# Altium project LM2596_DC_DC_BUCKCONVERTER.PrjPcb
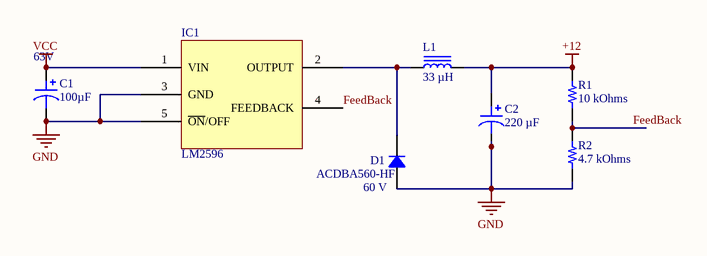
[diagram p0: Sheet1.SchDoc]
1 sheet, 7 parts. Net scope: global (net labels, ports and power ports of the same name join across sheets).
Board file: PCB1.PcbDoc

## Sheet Sheet1.SchDoc
size B; SheetNumber: 1; SheetTotal: 1

### Parts
C1  100µF  Voltage - Rated: 63V  [CAP TH ALUM ELEC D10.00mm S5.00mm H10.50mm]
C2  220 µF  [CAP TH ALPOLY D8.00mm S3.50mm H13.50mm]
D1  ACDBA560-HF  Voltage - DC Reverse (Vr) (Max): 60 V  [DO214AC SMA]
IC1  LM2596  [D2PAK]
L1  33 µH  [BOURNS SRR1280]
R1  10 kOhms  [RES 0805_2012]
R2  4.7 kOhms  [RES 0805_2012]

### Nets
+12: C2.1 L1.2 R1.2
GND: C1.2 C2.2 D1.1 IC1.3(GND) IC1.5(~{ON}/OFF) R2.1
VCC: C1.1 IC1.1(VIN)
FeedBack: IC1.4(FEEDBACK) R1.1 R2.2
NetD1_2: D1.2 IC1.2(OUTPUT) L1.1

### Library data of the parts
C1 = URS1J101MPD1TD: CAP ALUM 100UF 20% 63V RADIAL; manufacturer: Nichicon; Lifetime @ Temp.: 2000 Hrs @ 85°C; Polarization: Polar; Ripple Current @ High Frequency: 375mA @ 10kHz; Ripple Current @ Low Frequency: 250mA @ 120Hz; Part Number: URS1J101MPD1TD; Applications: General Purpose; Capacitance: 100µF; componentlink1description: Datasheet; componentlink1url: http://nichicon-us.com/english/products/pdfs/e-urs.pdf; componentlink2description: DigiKey Link; componentlink2url: http://digikey.com/product-detail/en/nichicon/URS1J101MPD1TD/493-11829-1-ND/4320229; Device Package: Radial, Can; Height - Seated (Max): 0.413" (10.50mm); lastupdated: 2.09.2020 01:26:22; Lead Spacing: 0.197" (5.00mm); Lifecycle Status: Active; Minimum Order: 1; Mounting Type: Through Hole; Operating Temperature: -40°C ~ 85°C; Package / Case: Radial, Can; packaging: TapeAndBox; partid: 9501; Part Status: Active; price: 0.18; series: URS; Size / Dimension: 0.394" Dia (10.00mm); Supplier 1: DigiKey; Supplier Part Number 1: 493-11829-1-ND; Tolerance: ±20%; value: 100µF
C2 = 227AVG035MFBJ: CAP ALUM POLY 220UF 20% 35V T/H; manufacturer: Illinois Capacitor; ESR (Equivalent Series Resistance): 26mOhm; Lifetime @ Temp.: 1500 Hrs @ 125°C; Ripple Current @ High Frequency: 2.95 A @ 100 kHz; Ripple Current @ Low Frequency: 147.5 mA @ 120 Hz; Type: Polymer; Part Number: 227AVG035MFBJ; Value: 220 µF; Applications: General Purpose; Capacitance: 220 µF; componentlink1description: Datasheet; componentlink1url: http://www.illinoiscapacitor.com/pdf/seriesDocuments/AVG%20series.pdf; componentlink2description: DigiKey Link; componentlink2url: https://www.digikey.com/en/products/detail/illinois-capacitor/227AVG035MFBJ/5411696; Device Package: Radial, Can; Height - Seated (Max): 0.532" (13.50mm); lastupdated: 6.05.2023 20:46:02; Lead Spacing: 0.138" (3.50mm); Lifecycle Status: Active; Minimum Order: 1; Mounting Type: Through Hole; Operating Temperature: -55°C ~ 125°C; Package / Case: Radial, Can; packaging: Bulk; partid: 3875; Part Status: Active; price: 1.05; series: AVG; Size / Dimension: 0.315" Dia (8.00mm); Supplier 1: DigiKey; Supplier Part Number 1: 1572-1695-ND; Tolerance: ±20%; Voltage - Rated: 35 V
D1 = ACDBA560-HF: DIODE SCHOTTKY 60V 5A DO214AC; Manufacturer: Comchip Technology; Capacitance @ Vr, F: 250pF @ 4V, 1MHz; Current - Reverse Leakage @ Vr: 500 µA @ 60 V; Speed: Fast Recovery =< 500ns, > 200mA (Io); Voltage - Forward (Vf) (Max) @ If: 700 mV @ 5 A; Part Number: ACDBA560-HF; ComponentLink1Description: Datasheet; ComponentLink1URL: http://www.comchiptech.com/admin/files/product/ACDBA560-HF%20RevA201382.pdf; ComponentLink2Description: DigiKey Link; ComponentLink2URL: https://www.digikey.com/en/products/detail/comchip-technology/ACDBA560-HF/7100903; Current - Average Rectified (Io): 5A; Diode Type: Schottky; LastUpdated: 6.05.2023 20:10:43; Lifecycle Status: Active; Minimum Order: 1; Mounting Type: Surface Mount; Operating Temperature - Junction: -55°C ~ 125°C; Package / Case: DO-214AC, SMA; Packaging: TapeAndReel; PartId: 1832; Part Status: Active; Price: 0.15; Series: Automotive, AEC-Q101; Supplier 1: DigiKey; Supplier Part Number 1: 641-2078-1-ND; Supplier Device Package: DO-214AC (SMA)
L1 = SRR1280-330M: FIXED IND 33UH 3.5A 57 MOHM SMD; Manufacturer: Bourns Inc.; Current - Saturation: 3.3A; DC Resistance (DCR): 57mOhm Max; Frequency - Self Resonant: 9.5MHz; Inductance Frequency - Test: 100 kHz; Material - Core: Ferrite; Q @ Freq: 28 @ 2.52MHz; Shielding: Shielded; Tolerance: ±20%; Type: Drum Core, Wirewound; Part Number: SRR1280-330M; ComponentLink1Description: Datasheet; ComponentLink1URL: https://www.bourns.com/docs/Product-Datasheets/SRR1280.pdf; ComponentLink2Description: DigiKey Link; ComponentLink2URL: https://www.digikey.com/en/products/detail/bourns-inc/SRR1280-330M/1969998; Current Rating (Amps): 3.5 A; Device Package: Nonstandard; Height - Seated (Max): 0.315" (8.00mm); Inductance: 33 µH; LastUpdated: 6.05.2023 20:20:35; Lifecycle Status: Active; Minimum Order: 1; Mounting Type: Surface Mount; Operating Temperature: -40°C ~ 125°C; Package / Case: Nonstandard; Packaging: TapeAndReel; PartId: 25; Part Status: Active; Price: 0.53; Series: SRR1280; Size / Dimension: 0.492" L x 0.492" W (12.50mm x 12.50mm); Supplier 1: DigiKey; Supplier Part Number 1: SRR1280-330MCT-ND; Value: 33 µH
R1 = CRGP0805F10K: RES 10K OHM 1% 1/3W 0805; Manufacturer: TE Connectivity Passive Product; Power (Watts): 0.333W, 1/3W; Temperature Coefficient: ±100ppm/°C; Part Number: CRGP0805F10K; Value: 10 kOhms; ComponentLink1Description: Datasheet; ComponentLink1URL: https://www.te.com/commerce/DocumentDelivery/DDEController?Action=srchrtrv&DocNm=9-1773463-9&DocType=DS&DocLang=English; ComponentLink2Description: DigiKey Link; ComponentLink2URL: https://www.digikey.com/en/products/detail/te-connectivity-passive-product/CRGP0805F10K/8577091; Composition: Thick Film; Device Package: 0805 (2012 Metric); Features: Pulse Withstanding; Height - Seated (Max): 0.026" (0.65mm); LastUpdated: 6.05.2023 19:56:35; Lifecycle Status: Active; Minimum Order: 1; Number of Terminations: 2; Operating Temperature: -55°C ~ 155°C; Package / Case: 0805 (2012 Metric); Packaging: TapeAndReel; PartId: 41700; Part Status: Active; Price: 0.02; Resistance: 10 kOhms; Series: CRGP; Size / Dimension: 0.079" L x 0.049" W (2.00mm x 1.25mm); Supplier 1: DigiKey; Supplier Part Number 1: A130489CT-ND; Supplier Device Package: 0805; Tolerance: ±1%
R2 = CRGP0805F4K7: RES 4.7K OHM 1% 1/3W 0805; Manufacturer: TE Connectivity Passive Product; Power (Watts): 0.333W, 1/3W; Temperature Coefficient: ±100ppm/°C; Part Number: CRGP0805F4K7; Value: 4.7 kOhms; ComponentLink1Description: Datasheet; ComponentLink1URL: https://www.te.com/commerce/DocumentDelivery/DDEController?Action=srchrtrv&DocNm=9-1773463-9&DocType=DS&DocLang=English; ComponentLink2Description: DigiKey Link; ComponentLink2URL: https://www.digikey.com/en/products/detail/te-connectivity-passive-product/CRGP0805F4K7/8577087; Composition: Thick Film; Device Package: 0805 (2012 Metric); Features: Pulse Withstanding; Height - Seated (Max): 0.026" (0.65mm); LastUpdated: 6.05.2023 19:57:17; Lifecycle Status: Active; Minimum Order: 1; Number of Terminations: 2; Operating Temperature: -55°C ~ 155°C; Package / Case: 0805 (2012 Metric); Packaging: TapeAndReel; PartId: 28726; Part Status: Active; Price: 0.02; Resistance: 4.7 kOhms; Series: CRGP; Size / Dimension: 0.079" L x 0.049" W (2.00mm x 1.25mm); Supplier 1: DigiKey; Supplier Part Number 1: A130485CT-ND; Supplier Device Package: 0805; Tolerance: ±1%